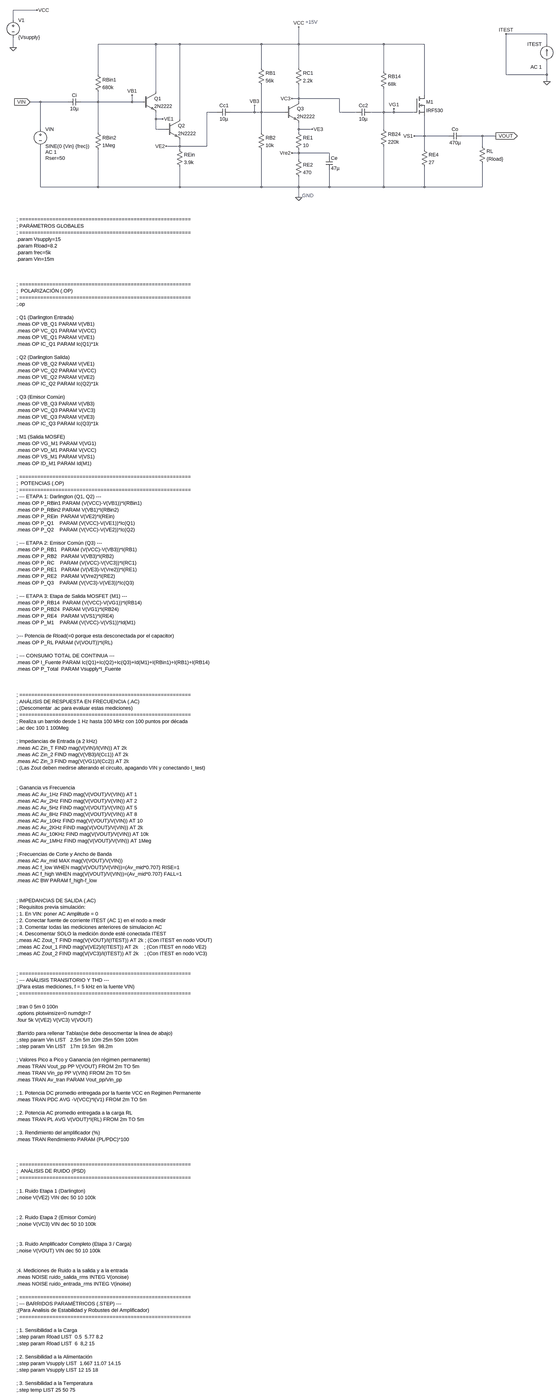
[diagram p0: schematic amplificador_tp2.asc, whole sheet]
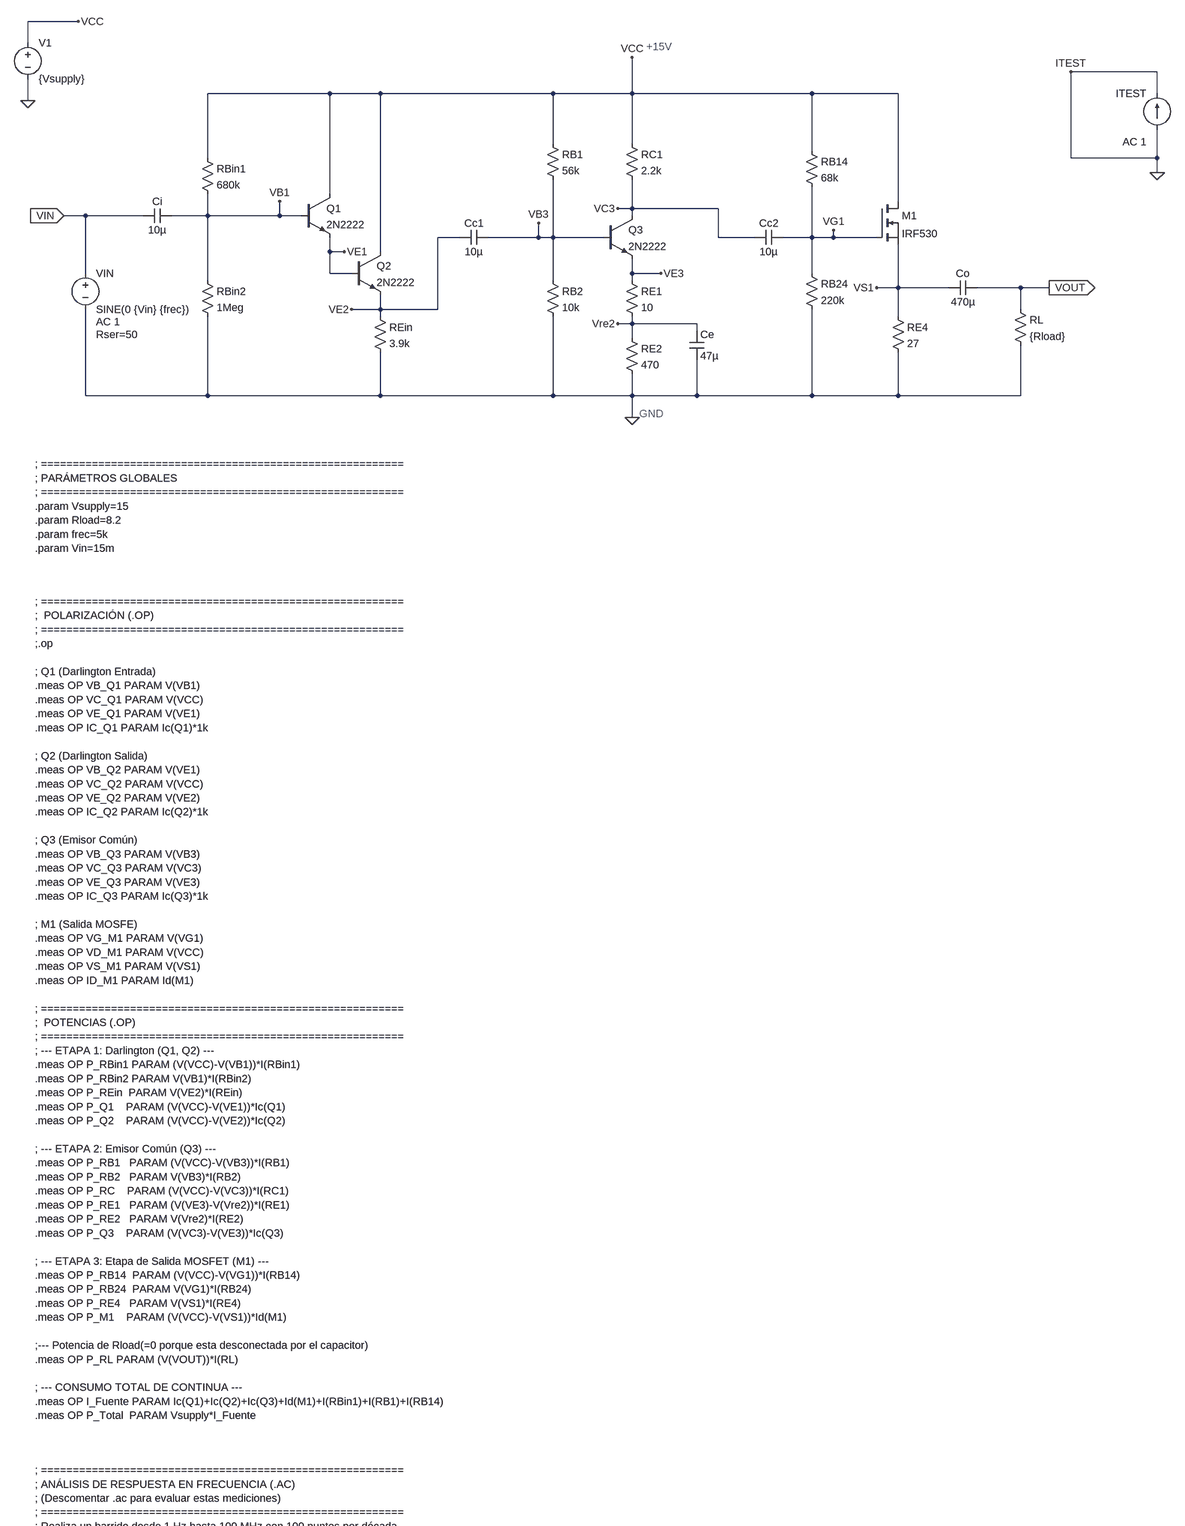
[diagram p1: schematic amplificador_tp2.asc, part, row 1 of 2, column 1 of 1]
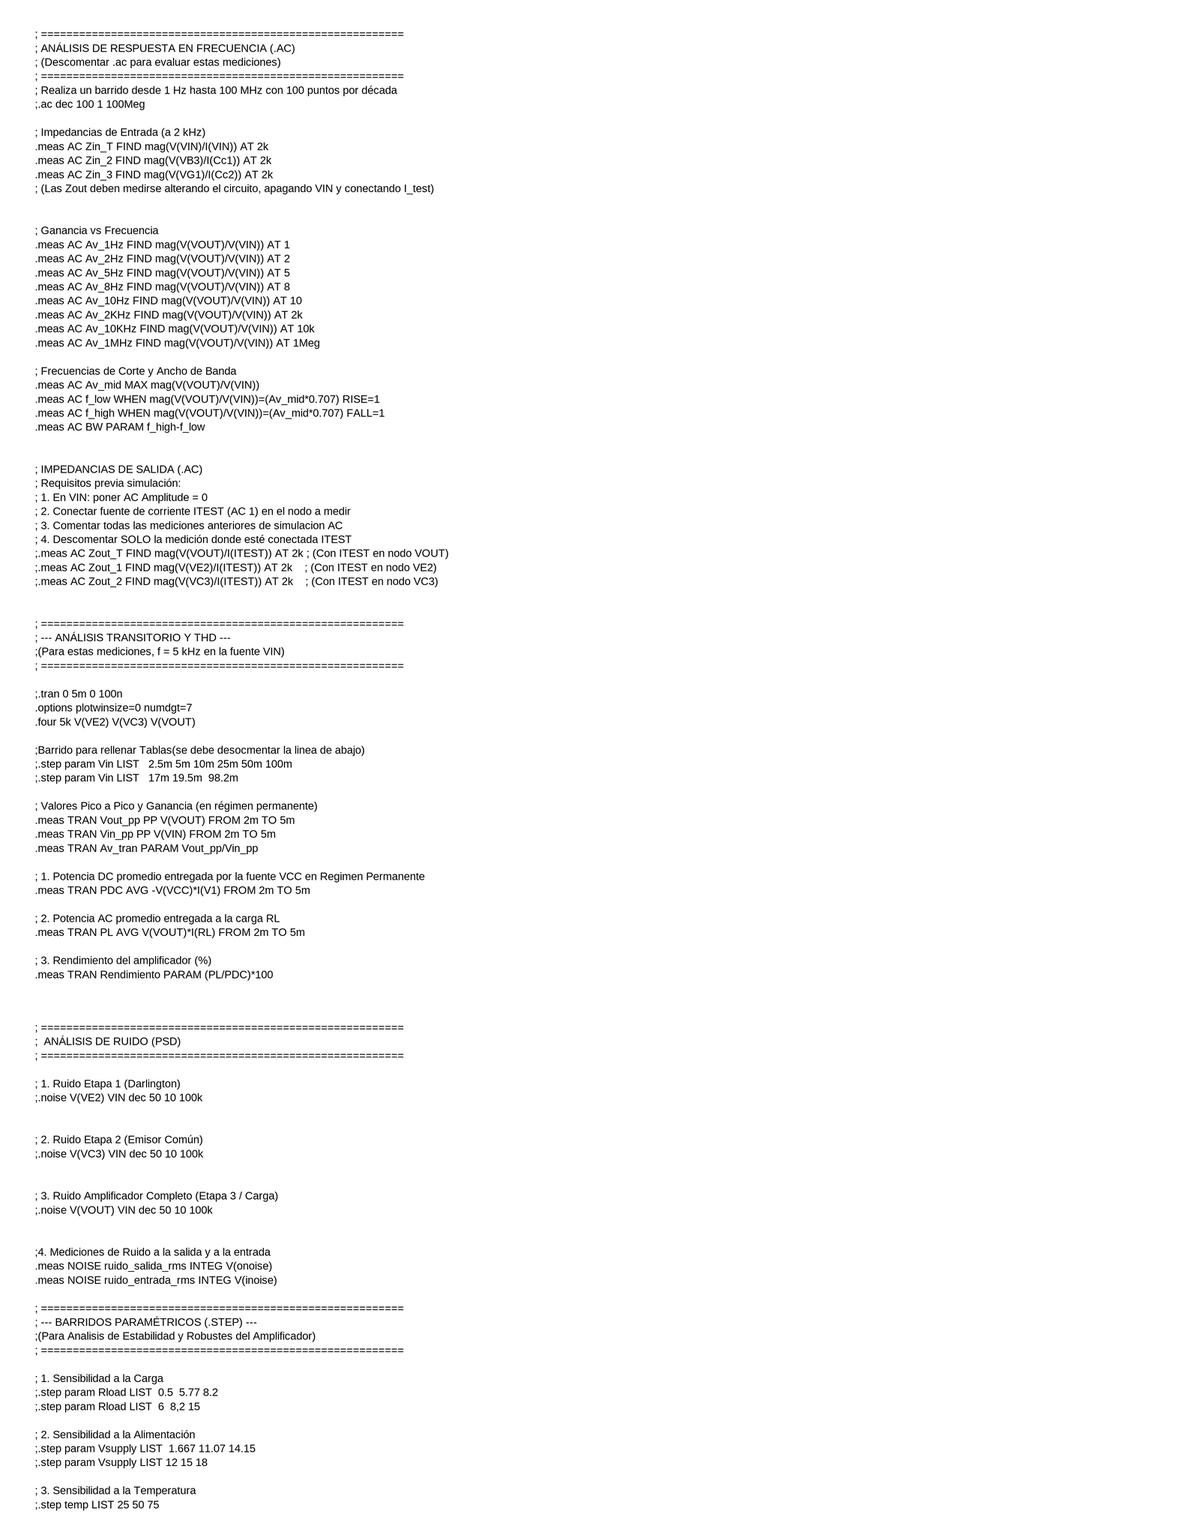
[diagram p2: schematic amplificador_tp2.asc, part, row 2 of 2, column 1 of 1]
amplificador_tp2.asc, the LTspice schematic file:
Version 4.1
SHEET 1 2644 5696
WIRE -384 -288 -496 -288
WIRE -496 -240 -496 -288
WIRE 2016 -176 1824 -176
WIRE 176 -128 -96 -128
WIRE 288 -128 176 -128
WIRE 672 -128 288 -128
WIRE 848 -128 848 -208
WIRE 848 -128 672 -128
WIRE 1248 -128 848 -128
WIRE 1440 -128 1248 -128
WIRE 2016 -128 2016 -176
WIRE -496 -112 -496 -160
WIRE 672 -16 672 -128
WIRE 848 -16 848 -128
WIRE 1248 0 1248 -128
WIRE -96 16 -96 -128
WIRE 1824 16 1824 -176
WIRE 2016 16 2016 -48
WIRE 2016 16 1824 16
WIRE 2016 48 2016 16
WIRE 176 96 176 -128
WIRE 1440 112 1440 -128
WIRE 848 128 848 64
WIRE 848 128 816 128
WIRE 1040 128 848 128
WIRE -368 144 -416 144
WIRE -240 144 -368 144
WIRE -96 144 -96 96
WIRE -96 144 -176 144
WIRE 64 144 64 112
WIRE 64 144 -96 144
WIRE 112 144 64 144
WIRE 848 144 848 128
WIRE 464 192 416 192
WIRE 640 192 640 160
WIRE 640 192 528 192
WIRE 672 192 672 64
WIRE 672 192 640 192
WIRE 784 192 672 192
WIRE 1040 192 1040 128
WIRE 1120 192 1040 192
WIRE 1248 192 1248 80
WIRE 1248 192 1184 192
WIRE 1296 192 1296 176
WIRE 1296 192 1248 192
WIRE 1392 192 1296 192
WIRE 176 224 176 192
WIRE 208 224 176 224
WIRE 288 224 288 -128
WIRE -368 272 -368 144
WIRE 176 272 176 224
WIRE 224 272 176 272
WIRE 848 272 848 240
WIRE 912 272 848 272
WIRE 1248 272 1248 192
WIRE -96 288 -96 144
WIRE 672 288 672 192
WIRE 848 288 848 272
WIRE 1440 304 1440 208
WIRE 1440 304 1392 304
WIRE 1552 304 1440 304
WIRE 1712 304 1616 304
WIRE 1776 304 1712 304
WIRE 288 352 288 320
WIRE 288 352 224 352
WIRE 416 352 416 192
WIRE 416 352 288 352
WIRE 1712 352 1712 304
WIRE 288 368 288 352
WIRE 1440 368 1440 304
WIRE 848 384 848 368
WIRE 848 384 816 384
WIRE 992 384 848 384
WIRE 992 400 992 384
WIRE 848 416 848 384
WIRE -368 544 -368 352
WIRE -96 544 -96 368
WIRE -96 544 -368 544
WIRE 288 544 288 448
WIRE 288 544 -96 544
WIRE 672 544 672 368
WIRE 672 544 288 544
WIRE 848 544 848 496
WIRE 848 544 672 544
WIRE 992 544 992 464
WIRE 992 544 848 544
WIRE 1248 544 1248 352
WIRE 1248 544 992 544
WIRE 1440 544 1440 448
WIRE 1440 544 1248 544
WIRE 1712 544 1712 432
WIRE 1712 544 1440 544
WIRE 848 592 848 544
FLAG -384 -288 VCC
FLAG -496 -112 0
FLAG 848 592 0
FLAG 848 -208 VCC
FLAG -416 144 VIN
IOPIN -416 144 In
FLAG 1776 304 VOUT
IOPIN 1776 304 Out
FLAG 816 128 VC3
FLAG 64 112 VB1
FLAG 640 160 VB3
FLAG 912 272 VE3
FLAG 1296 176 VG1
FLAG 208 224 VE1
FLAG 224 352 VE2
FLAG 1392 304 VS1
FLAG 816 384 Vre2
FLAG 1824 -176 ITEST
FLAG 2016 48 0
SYMBOL npn 112 96 R0
SYMATTR InstName Q1
SYMATTR Value 2N2222
SYMBOL npn 224 224 R0
SYMATTR InstName Q2
SYMATTR Value 2N2222
SYMBOL npn 784 144 R0
SYMATTR InstName Q3
SYMATTR Value 2N2222
SYMBOL voltage -496 -256 R0
WINDOW 123 0 0 Left 0
WINDOW 39 0 0 Left 0
SYMATTR InstName V1
SYMATTR Value {Vsupply}
SYMBOL voltage -368 256 R0
WINDOW 123 24 124 Left 2
WINDOW 39 24 152 Left 2
SYMATTR Value2 AC 1
SYMATTR SpiceLine Rser=50
SYMATTR InstName VIN
SYMATTR Value SINE(0 {Vin} {frec})
SYMBOL cap -176 128 R90
WINDOW 0 0 32 VBottom 2
WINDOW 3 32 32 VTop 2
SYMATTR InstName Ci
SYMATTR Value 10µ
SYMBOL res -112 0 R0
SYMATTR InstName RBin1
SYMATTR Value 680k
SYMBOL res 272 352 R0
SYMATTR InstName REin
SYMATTR Value 3.9k
SYMBOL cap 528 176 R90
WINDOW 0 0 32 VBottom 2
WINDOW 3 32 32 VTop 2
SYMATTR InstName Cc1
SYMATTR Value 10µ
SYMBOL res 656 -32 R0
SYMATTR InstName RB1
SYMATTR Value 56k
SYMBOL res 656 272 R0
SYMATTR InstName RB2
SYMATTR Value 10k
SYMBOL res 832 -32 R0
SYMATTR InstName RC1
SYMATTR Value 2.2k
SYMBOL res 832 272 R0
SYMATTR InstName RE1
SYMATTR Value 10
SYMBOL res 832 400 R0
SYMATTR InstName RE2
SYMATTR Value 470
SYMBOL cap 1184 176 R90
WINDOW 0 0 32 VBottom 2
WINDOW 3 32 32 VTop 2
SYMATTR InstName Cc2
SYMATTR Value 10µ
SYMBOL cap 976 400 R0
SYMATTR InstName Ce
SYMATTR Value 47µ
SYMBOL res 1232 -16 R0
SYMATTR InstName RB14
SYMATTR Value 68k
SYMBOL res 1232 256 R0
SYMATTR InstName RB24
SYMATTR Value 220k
SYMBOL res 1424 352 R0
SYMATTR InstName RE4
SYMATTR Value 27
SYMBOL cap 1616 288 R90
WINDOW 0 0 32 VBottom 2
WINDOW 3 32 32 VTop 2
SYMATTR InstName Co
SYMATTR Value 470µ
SYMBOL res 1696 336 R0
SYMATTR InstName RL
SYMATTR Value {Rload}
SYMBOL res -112 272 R0
SYMATTR InstName RBin2
SYMATTR Value 1Meg
SYMBOL nmos 1392 112 R0
SYMATTR InstName M1
SYMATTR Value IRF530
SYMBOL current 2016 -48 R180
WINDOW 0 24 80 Left 2
WINDOW 3 24 0 Left 2
WINDOW 123 24 -28 Left 2
WINDOW 39 0 0 Left 0
SYMATTR InstName ITEST
SYMATTR Value ""
SYMATTR Value2 AC 1
TEXT -480 696 Left 2 !; =========================================================\n; PARÁMETROS GLOBALES\n; =========================================================\n.param Vsupply=15\n.param Rload=8.2\n.param frec=5k\n.param Vin=15m \n \n \n \n; =========================================================\n;  POLARIZACIÓN (.OP)\n; =========================================================\n;.op  \n \n; Q1 (Darlington Entrada)\n.meas OP VB_Q1 PARAM V(VB1)\n.meas OP VC_Q1 PARAM V(VCC)\n.meas OP VE_Q1 PARAM V(VE1)\n.meas OP IC_Q1 PARAM Ic(Q1)*1k\n \n; Q2 (Darlington Salida)\n.meas OP VB_Q2 PARAM V(VE1)\n.meas OP VC_Q2 PARAM V(VCC)\n.meas OP VE_Q2 PARAM V(VE2)\n.meas OP IC_Q2 PARAM Ic(Q2)*1k\n \n; Q3 (Emisor Común)\n.meas OP VB_Q3 PARAM V(VB3)\n.meas OP VC_Q3 PARAM V(VC3)\n.meas OP VE_Q3 PARAM V(VE3)\n.meas OP IC_Q3 PARAM Ic(Q3)*1k\n \n; M1 (Salida MOSFE)\n.meas OP VG_M1 PARAM V(VG1)\n.meas OP VD_M1 PARAM V(VCC)\n.meas OP VS_M1 PARAM V(VS1)\n.meas OP ID_M1 PARAM Id(M1)\n \n; =========================================================\n;  POTENCIAS (.OP)\n; =========================================================\n; --- ETAPA 1: Darlington (Q1, Q2) ---\n.meas OP P_RBin1 PARAM (V(VCC)-V(VB1))*I(RBin1)\n.meas OP P_RBin2 PARAM V(VB1)*I(RBin2)\n.meas OP P_REin  PARAM V(VE2)*I(REin)\n.meas OP P_Q1    PARAM (V(VCC)-V(VE1))*Ic(Q1)\n.meas OP P_Q2    PARAM (V(VCC)-V(VE2))*Ic(Q2)\n \n; --- ETAPA 2: Emisor Común (Q3) ---\n.meas OP P_RB1   PARAM (V(VCC)-V(VB3))*I(RB1)\n.meas OP P_RB2   PARAM V(VB3)*I(RB2)\n.meas OP P_RC    PARAM (V(VCC)-V(VC3))*I(RC1)\n.meas OP P_RE1   PARAM (V(VE3)-V(Vre2))*I(RE1)\n.meas OP P_RE2   PARAM V(Vre2)*I(RE2)\n.meas OP P_Q3    PARAM (V(VC3)-V(VE3))*Ic(Q3)\n \n; --- ETAPA 3: Etapa de Salida MOSFET (M1) ---\n.meas OP P_RB14  PARAM (V(VCC)-V(VG1))*I(RB14)\n.meas OP P_RB24  PARAM V(VG1)*I(RB24)\n.meas OP P_RE4   PARAM V(VS1)*I(RE4)\n.meas OP P_M1    PARAM (V(VCC)-V(VS1))*Id(M1)\n \n;--- Potencia de Rload(=0 porque esta desconectada por el capacitor)\n.meas OP P_RL PARAM (V(VOUT))*I(RL)\n \n; --- CONSUMO TOTAL DE CONTINUA ---\n.meas OP I_Fuente PARAM Ic(Q1)+Ic(Q2)+Ic(Q3)+Id(M1)+I(RBin1)+I(RB1)+I(RB14)\n.meas OP P_Total  PARAM Vsupply*I_Fuente\n \n \n \n; =========================================================\n; ANÁLISIS DE RESPUESTA EN FRECUENCIA (.AC) \n; (Descomentar .ac para evaluar estas mediciones)\n; =========================================================\n; Realiza un barrido desde 1 Hz hasta 100 MHz con 100 puntos por década\n;.ac dec 100 1 100Meg\n \n; Impedancias de Entrada (a 2 kHz)\n.meas AC Zin_T FIND mag(V(VIN)/I(VIN)) AT 2k\n.meas AC Zin_2 FIND mag(V(VB3)/I(Cc1)) AT 2k\n.meas AC Zin_3 FIND mag(V(VG1)/I(Cc2)) AT 2k\n; (Las Zout deben medirse alterando el circuito, apagando VIN y conectando I_test)\n \n \n; Ganancia vs Frecuencia\n.meas AC Av_1Hz FIND mag(V(VOUT)/V(VIN)) AT 1\n.meas AC Av_2Hz FIND mag(V(VOUT)/V(VIN)) AT 2\n.meas AC Av_5Hz FIND mag(V(VOUT)/V(VIN)) AT 5\n.meas AC Av_8Hz FIND mag(V(VOUT)/V(VIN)) AT 8\n.meas AC Av_10Hz FIND mag(V(VOUT)/V(VIN)) AT 10\n.meas AC Av_2KHz FIND mag(V(VOUT)/V(VIN)) AT 2k\n.meas AC Av_10KHz FIND mag(V(VOUT)/V(VIN)) AT 10k\n.meas AC Av_1MHz FIND mag(V(VOUT)/V(VIN)) AT 1Meg\n \n; Frecuencias de Corte y Ancho de Banda\n.meas AC Av_mid MAX mag(V(VOUT)/V(VIN))\n.meas AC f_low WHEN mag(V(VOUT)/V(VIN))=(Av_mid*0.707) RISE=1\n.meas AC f_high WHEN mag(V(VOUT)/V(VIN))=(Av_mid*0.707) FALL=1\n.meas AC BW PARAM f_high-f_low\n \n \n; IMPEDANCIAS DE SALIDA (.AC)\n; Requisitos previa simulación:\n; 1. En VIN: poner AC Amplitude = 0 \n; 2. Conectar fuente de corriente ITEST (AC 1) en el nodo a medir\n; 3. Comentar todas las mediciones anteriores de simulacion AC\n; 4. Descomentar SOLO la medición donde esté conectada ITEST\n;.meas AC Zout_T FIND mag(V(VOUT)/I(ITEST)) AT 2k ; (Con ITEST en nodo VOUT)\n;.meas AC Zout_1 FIND mag(V(VE2)/I(ITEST)) AT 2k    ; (Con ITEST en nodo VE2)\n;.meas AC Zout_2 FIND mag(V(VC3)/I(ITEST)) AT 2k    ; (Con ITEST en nodo VC3)\n \n \n; =========================================================\n; --- ANÁLISIS TRANSITORIO Y THD ---\n;(Para estas mediciones, f = 5 kHz en la fuente VIN)\n; =========================================================\n \n;.tran 0 5m 0 100n\n.options plotwinsize=0 numdgt=7\n.four 5k V(VE2) V(VC3) V(VOUT)\n \n;Barrido para rellenar Tablas(se debe desocmentar la linea de abajo)\n;.step param Vin LIST   2.5m 5m 10m 25m 50m 100m\n;.step param Vin LIST   17m 19.5m  98.2m\n \n; Valores Pico a Pico y Ganancia (en régimen permanente)\n.meas TRAN Vout_pp PP V(VOUT) FROM 2m TO 5m\n.meas TRAN Vin_pp PP V(VIN) FROM 2m TO 5m\n.meas TRAN Av_tran PARAM Vout_pp/Vin_pp\n \n; 1. Potencia DC promedio entregada por la fuente VCC en Regimen Permanente\n.meas TRAN PDC AVG -V(VCC)*I(V1) FROM 2m TO 5m\n \n; 2. Potencia AC promedio entregada a la carga RL\n.meas TRAN PL AVG V(VOUT)*I(RL) FROM 2m TO 5m\n \n; 3. Rendimiento del amplificador (%)\n.meas TRAN Rendimiento PARAM (PL/PDC)*100\n \n \n \n \n; =========================================================\n;  ANÁLISIS DE RUIDO (PSD) \n; =========================================================\n \n; 1. Ruido Etapa 1 (Darlington)\n;.noise V(VE2) VIN dec 50 10 100k\n \n \n; 2. Ruido Etapa 2 (Emisor Común)\n;.noise V(VC3) VIN dec 50 10 100k\n \n \n; 3. Ruido Amplificador Completo (Etapa 3 / Carga)\n;.noise V(VOUT) VIN dec 50 10 100k\n \n \n;4. Mediciones de Ruido a la salida y a la entrada\n.meas NOISE ruido_salida_rms INTEG V(onoise)\n.meas NOISE ruido_entrada_rms INTEG V(inoise)\n \n; =========================================================\n; --- BARRIDOS PARAMÉTRICOS (.STEP) ---\n;(Para Analisis de Estabilidad y Robustes del Amplificador)\n; =========================================================\n \n; 1. Sensibilidad a la Carga\n;.step param Rload LIST  0.5  5.77 8.2\n;.step param Rload LIST  6  8,2 15\n \n; 2. Sensibilidad a la Alimentación\n;.step param Vsupply LIST  1.667 11.07 14.15\n;.step param Vsupply LIST 12 15 18\n \n; 3. Sensibilidad a la Temperatura\n;.step temp LIST 25 50 75
TEXT 880 -232 Left 2 ;+15V
TEXT 864 584 Left 2 ;GND

The netlist it stands for:
* amplificador_tp2.asc
Q1 VCC VB1 VE1 0 2N2222
Q2 VCC VE1 VE2 0 2N2222
Q3 VC3 VB3 VE3 0 2N2222
V1 VCC 0 {Vsupply}
VIN VIN 0 SINE(0 {Vin} {frec}) AC 1 Rser=50
Ci VB1 VIN 10µ
RBin1 VCC VB1 680k
REin VE2 0 3.9k
Cc1 VB3 VE2 10µ
RB1 VCC VB3 56k
RB2 VB3 0 10k
RC1 VCC VC3 2.2k
RE1 VE3 Vre2 10
RE2 Vre2 0 470
Cc2 VG1 VC3 10µ
Ce Vre2 0 47µ
RB14 VCC VG1 68k
RB24 VG1 0 220k
RE4 VS1 0 27
Co VOUT VS1 470µ
RL VOUT 0 {Rload}
RBin2 VB1 0 1Meg
M1 VCC VG1 VS1 VS1 IRF530
ITEST 0 0 AC 1
.model NPN NPN
.model PNP PNP
.lib standard.bjt
.model NMOS NMOS
.model PMOS PMOS
.lib standard.mos
; =========================================================
; PARÁMETROS GLOBALES
; =========================================================
.param Vsupply=15
.param Rload=8.2
.param frec=5k
.param Vin=15m
; =========================================================
;  POLARIZACIÓN (.OP)
; =========================================================
;.op
; Q1 (Darlington Entrada)
.meas OP VB_Q1 PARAM V(VB1)
.meas OP VC_Q1 PARAM V(VCC)
.meas OP VE_Q1 PARAM V(VE1)
.meas OP IC_Q1 PARAM Ic(Q1)*1k
; Q2 (Darlington Salida)
.meas OP VB_Q2 PARAM V(VE1)
.meas OP VC_Q2 PARAM V(VCC)
.meas OP VE_Q2 PARAM V(VE2)
.meas OP IC_Q2 PARAM Ic(Q2)*1k
; Q3 (Emisor Común)
.meas OP VB_Q3 PARAM V(VB3)
.meas OP VC_Q3 PARAM V(VC3)
.meas OP VE_Q3 PARAM V(VE3)
.meas OP IC_Q3 PARAM Ic(Q3)*1k
; M1 (Salida MOSFE)
.meas OP VG_M1 PARAM V(VG1)
.meas OP VD_M1 PARAM V(VCC)
.meas OP VS_M1 PARAM V(VS1)
.meas OP ID_M1 PARAM Id(M1)
; =========================================================
;  POTENCIAS (.OP)
; =========================================================
; --- ETAPA 1: Darlington (Q1, Q2) ---
.meas OP P_RBin1 PARAM (V(VCC)-V(VB1))*I(RBin1)
.meas OP P_RBin2 PARAM V(VB1)*I(RBin2)
.meas OP P_REin  PARAM V(VE2)*I(REin)
.meas OP P_Q1    PARAM (V(VCC)-V(VE1))*Ic(Q1)
.meas OP P_Q2    PARAM (V(VCC)-V(VE2))*Ic(Q2)
; --- ETAPA 2: Emisor Común (Q3) ---
.meas OP P_RB1   PARAM (V(VCC)-V(VB3))*I(RB1)
.meas OP P_RB2   PARAM V(VB3)*I(RB2)
.meas OP P_RC    PARAM (V(VCC)-V(VC3))*I(RC1)
.meas OP P_RE1   PARAM (V(VE3)-V(Vre2))*I(RE1)
.meas OP P_RE2   PARAM V(Vre2)*I(RE2)
.meas OP P_Q3    PARAM (V(VC3)-V(VE3))*Ic(Q3)
; --- ETAPA 3: Etapa de Salida MOSFET (M1) ---
.meas OP P_RB14  PARAM (V(VCC)-V(VG1))*I(RB14)
.meas OP P_RB24  PARAM V(VG1)*I(RB24)
.meas OP P_RE4   PARAM V(VS1)*I(RE4)
.meas OP P_M1    PARAM (V(VCC)-V(VS1))*Id(M1)
;--- Potencia de Rload(=0 porque esta desconectada por el capacitor)
.meas OP P_RL PARAM (V(VOUT))*I(RL)
; --- CONSUMO TOTAL DE CONTINUA ---
.meas OP I_Fuente PARAM Ic(Q1)+Ic(Q2)+Ic(Q3)+Id(M1)+I(RBin1)+I(RB1)+I(RB14)
.meas OP P_Total  PARAM Vsupply*I_Fuente
; =========================================================
; ANÁLISIS DE RESPUESTA EN FRECUENCIA (.AC)
; (Descomentar .ac para evaluar estas mediciones)
; =========================================================
; Realiza un barrido desde 1 Hz hasta 100 MHz con 100 puntos por década
;.ac dec 100 1 100Meg
; Impedancias de Entrada (a 2 kHz)
.meas AC Zin_T FIND mag(V(VIN)/I(VIN)) AT 2k
.meas AC Zin_2 FIND mag(V(VB3)/I(Cc1)) AT 2k
.meas AC Zin_3 FIND mag(V(VG1)/I(Cc2)) AT 2k
; (Las Zout deben medirse alterando el circuito, apagando VIN y conectando I_test)
; Ganancia vs Frecuencia
.meas AC Av_1Hz FIND mag(V(VOUT)/V(VIN)) AT 1
.meas AC Av_2Hz FIND mag(V(VOUT)/V(VIN)) AT 2
.meas AC Av_5Hz FIND mag(V(VOUT)/V(VIN)) AT 5
.meas AC Av_8Hz FIND mag(V(VOUT)/V(VIN)) AT 8
.meas AC Av_10Hz FIND mag(V(VOUT)/V(VIN)) AT 10
.meas AC Av_2KHz FIND mag(V(VOUT)/V(VIN)) AT 2k
.meas AC Av_10KHz FIND mag(V(VOUT)/V(VIN)) AT 10k
.meas AC Av_1MHz FIND mag(V(VOUT)/V(VIN)) AT 1Meg
; Frecuencias de Corte y Ancho de Banda
.meas AC Av_mid MAX mag(V(VOUT)/V(VIN))
.meas AC f_low WHEN mag(V(VOUT)/V(VIN))=(Av_mid*0.707) RISE=1
.meas AC f_high WHEN mag(V(VOUT)/V(VIN))=(Av_mid*0.707) FALL=1
.meas AC BW PARAM f_high-f_low
; IMPEDANCIAS DE SALIDA (.AC)
; Requisitos previa simulación:
; 1. En VIN: poner AC Amplitude = 0
; 2. Conectar fuente de corriente ITEST (AC 1) en el nodo a medir
; 3. Comentar todas las mediciones anteriores de simulacion AC
; 4. Descomentar SOLO la medición donde esté conectada ITEST
;.meas AC Zout_T FIND mag(V(VOUT)/I(ITEST)) AT 2k ; (Con ITEST en nodo VOUT)
;.meas AC Zout_1 FIND mag(V(VE2)/I(ITEST)) AT 2k    ; (Con ITEST en nodo VE2)
;.meas AC Zout_2 FIND mag(V(VC3)/I(ITEST)) AT 2k    ; (Con ITEST en nodo VC3)
; =========================================================
; --- ANÁLISIS TRANSITORIO Y THD ---
;(Para estas mediciones, f = 5 kHz en la fuente VIN)
; =========================================================
;.tran 0 5m 0 100n
.options plotwinsize=0 numdgt=7
.four 5k V(VE2) V(VC3) V(VOUT)
;Barrido para rellenar Tablas(se debe desocmentar la linea de abajo)
;.step param Vin LIST   2.5m 5m 10m 25m 50m 100m
;.step param Vin LIST   17m 19.5m  98.2m
; Valores Pico a Pico y Ganancia (en régimen permanente)
.meas TRAN Vout_pp PP V(VOUT) FROM 2m TO 5m
.meas TRAN Vin_pp PP V(VIN) FROM 2m TO 5m
.meas TRAN Av_tran PARAM Vout_pp/Vin_pp
; 1. Potencia DC promedio entregada por la fuente VCC en Regimen Permanente
.meas TRAN PDC AVG -V(VCC)*I(V1) FROM 2m TO 5m
; 2. Potencia AC promedio entregada a la carga RL
.meas TRAN PL AVG V(VOUT)*I(RL) FROM 2m TO 5m
; 3. Rendimiento del amplificador (%)
.meas TRAN Rendimiento PARAM (PL/PDC)*100
; =========================================================
;  ANÁLISIS DE RUIDO (PSD)
; =========================================================
; 1. Ruido Etapa 1 (Darlington)
;.noise V(VE2) VIN dec 50 10 100k
; 2. Ruido Etapa 2 (Emisor Común)
;.noise V(VC3) VIN dec 50 10 100k
; 3. Ruido Amplificador Completo (Etapa 3 / Carga)
;.noise V(VOUT) VIN dec 50 10 100k
;4. Mediciones de Ruido a la salida y a la entrada
.meas NOISE ruido_salida_rms INTEG V(onoise)
.meas NOISE ruido_entrada_rms INTEG V(inoise)
; =========================================================
; --- BARRIDOS PARAMÉTRICOS (.STEP) ---
;(Para Analisis de Estabilidad y Robustes del Amplificador)
; =========================================================
; 1. Sensibilidad a la Carga
;.step param Rload LIST  0.5  5.77 8.2
;.step param Rload LIST  6  8,2 15
; 2. Sensibilidad a la Alimentación
;.step param Vsupply LIST  1.667 11.07 14.15
;.step param Vsupply LIST 12 15 18
; 3. Sensibilidad a la Temperatura
;.step temp LIST 25 50 75
* +15V
* GND
.backanno
.end